# EAGLE design lin_node (EAGLE 6.5.0)
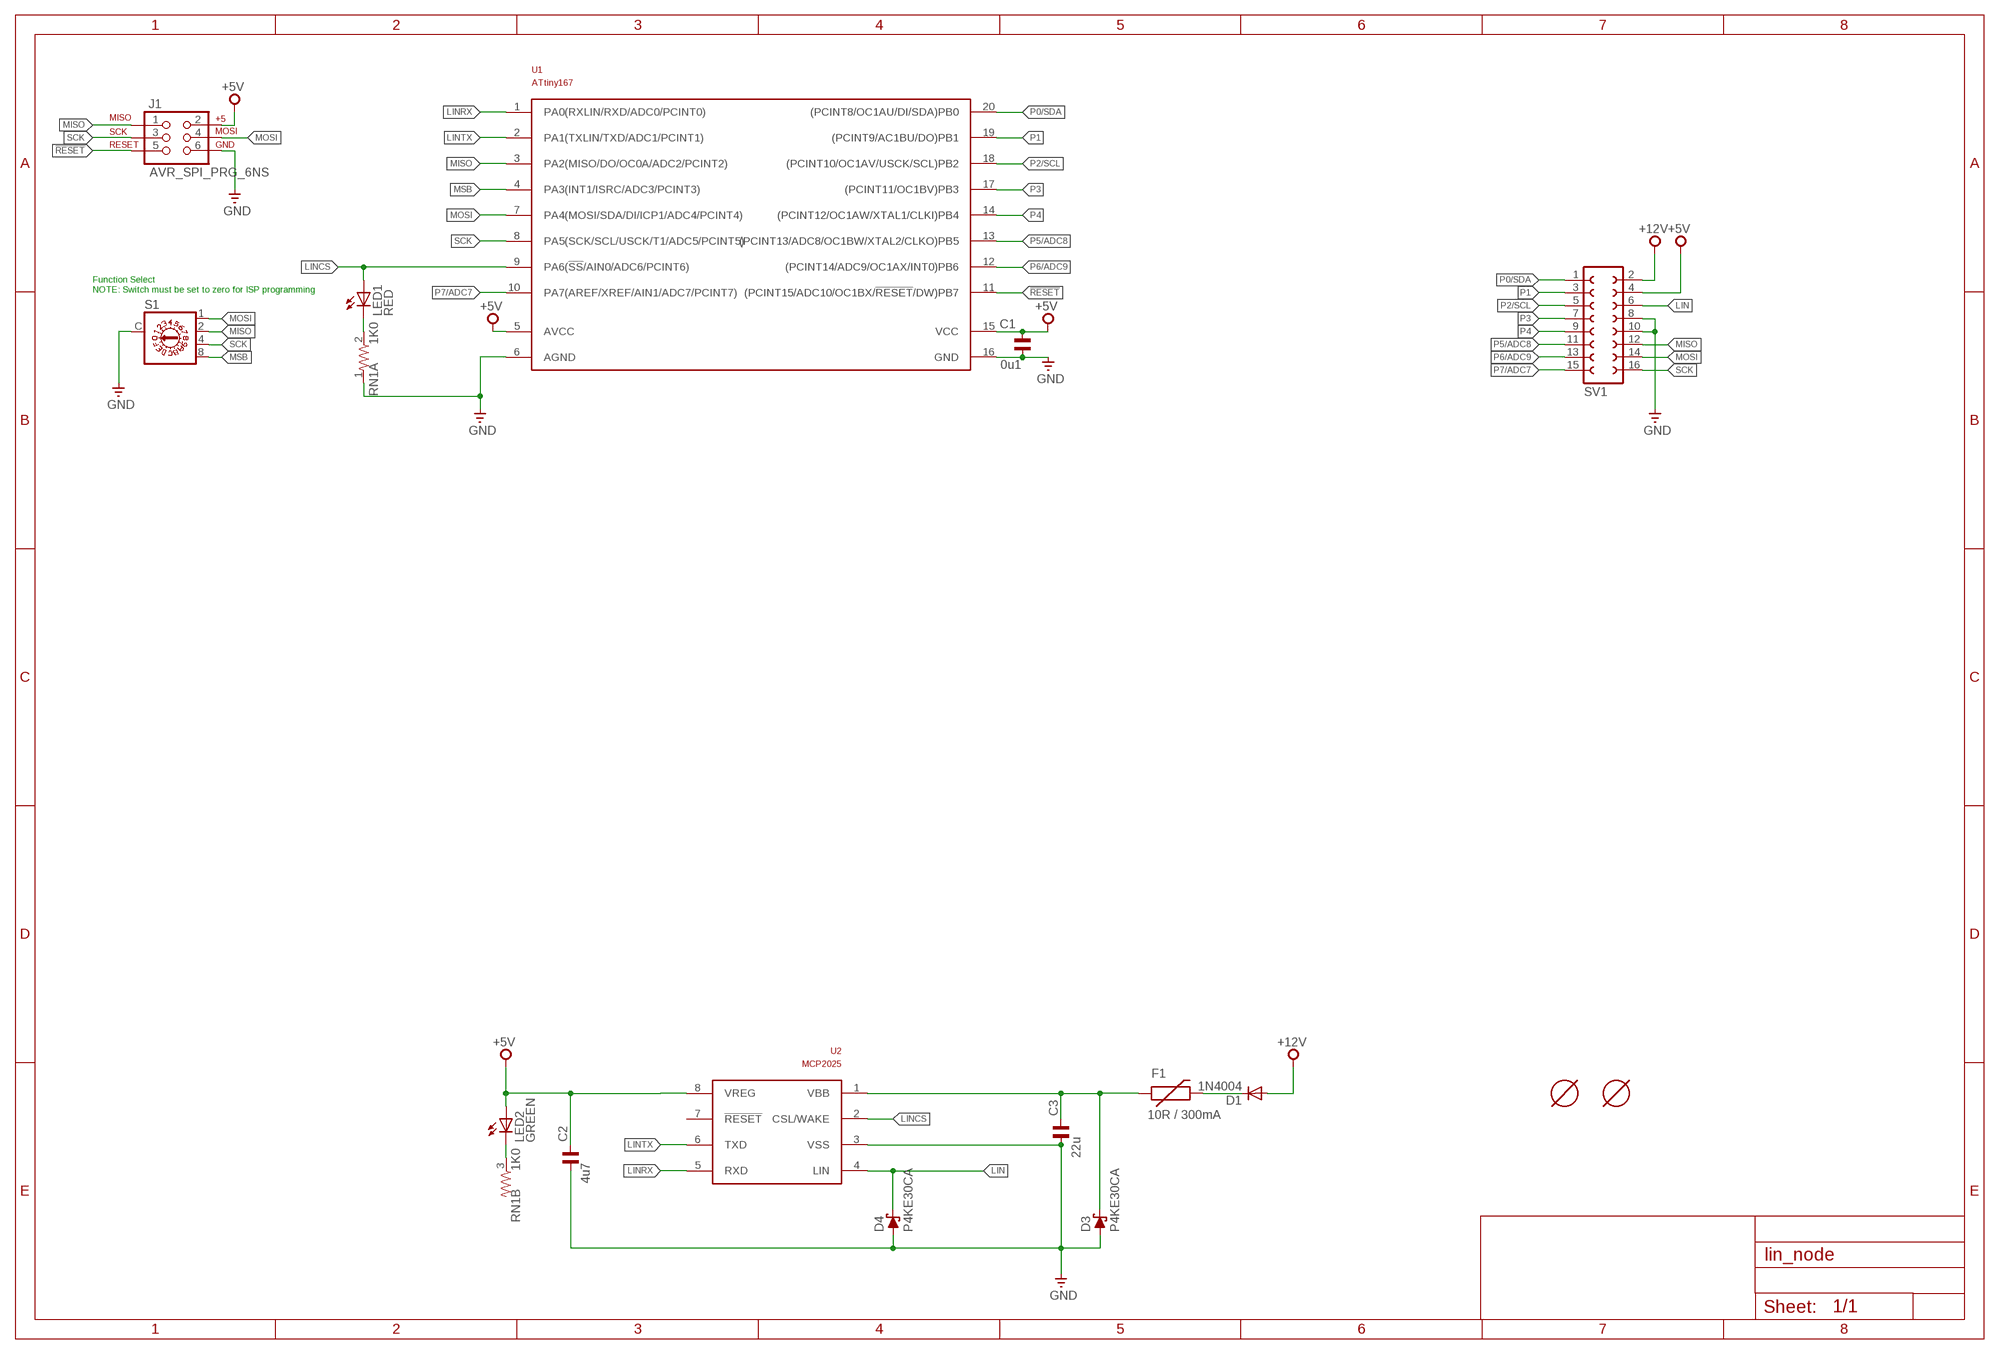
[diagram p0: schematic, sheet 1]

## Parts
C1  0u1  C-EU025-024X044  [C025-024X044]
C2  4u7  C-EU050-024X044  [C050-024X044]
C3  22u  C-EU050-024X044  [C050-024X044]
D1  1N4004  [DO41-10]
D3  P4KE30CA  P4KEXX  [DO41-10]
D4  P4KE30CA  P4KEXX  [DO41-10]
F1  10R / 300mA  PTCPTH  [PTC]
J1  AVR_SPI_PRG_6NS  [2X3-NS]
LED1  RED  LED3MM  [LED3MM]
LED2  GREEN  LED3MM  [LED3MM]
RN1  1K0  GE03R  [SIL4]
S1  P103  [P103]
SV1  FE08-2  [FE08-2]
U1  ATtiny167  ATTINY167  [SO20W]
U2  MCP2025  [SO08]
U$1  MOUNT-HOLE3.1MM  [MOUNT-HOLE3.1]
U$2  MOUNT-HOLE3.1MM  [MOUNT-HOLE3.1]

## Nets
!RESET: J1.5 U1.11((PCINT15/ADC10/OC1BX/!RESET!/DW)PB7)
+5V [power]: C1.1 C2.1 J1.2 LED2.A SV1.4 U1.5(AVCC) U1.15(VCC) U2.8(VREG)
+12V [power]: D1.A SV1.2
GND [power]: C1.2 C2.2 C3.2 D3.A D4.A J1.6 RN1.1 S1.C SV1.8 SV1.10 U1.6(AGND) U1.16(GND) U2.3(VSS)
LIN: D4.C SV1.6 U2.4(LIN)
LINCS: LED1.A U1.9(PA6(!SS!/AIN0/ADC6/PCINT6)) U2.2(CSL/WAKE)
LINRX: U1.1(PA0(RXLIN/RXD/ADC0/PCINT0)) U2.5(RXD)
LINTX: U1.2(PA1(TXLIN/TXD/ADC1/PCINT1)) U2.6(TXD)
MISO: J1.1 S1.2 SV1.12 U1.3(PA2(MISO/DO/OC0A/ADC2/PCINT2))
MOSI: J1.4 S1.1 SV1.14 U1.7(PA4(MOSI/SDA/DI/ICP1/ADC4/PCINT4))
MSB: S1.8 U1.4(PA3(INT1/ISRC/ADC3/PCINT3))
N$2 [power]: C3.1 D3.C F1.P$1 U2.1(VBB)
N$3: LED1.K(C) RN1.2
N$4: LED2.K(C) RN1.3
N$5 [power]: D1.C F1.P$2
P0/SDA: SV1.1 U1.20((PCINT8/OC1AU/DI/SDA)PB0)
P1: SV1.3 U1.19((PCINT9/AC1BU/DO)PB1)
P2/SCL: SV1.5 U1.18((PCINT10/OC1AV/USCK/SCL)PB2)
P3: SV1.7 U1.17((PCINT11/OC1BV)PB3)
P4: SV1.9 U1.14((PCINT12/OC1AW/XTAL1/CLKI)PB4)
P5/ADC8: SV1.11 U1.13((PCINT13/ADC8/OC1BW/XTAL2/CLKO)PB5)
P6/ADC9: SV1.13 U1.12((PCINT14/ADC9/OC1AX/INT0)PB6)
P7/ADC7: SV1.15 U1.10(PA7(AREF/XREF/AIN1/ADC7/PCINT7))
SCK: J1.3 S1.4 SV1.16 U1.8(PA5(SCK/SCL/USCK/T1/ADC5/PCINT5))
Unconnected: RN1.4 U2.7(!RESET)

## Notes on the sheet
- Function Select
  NOTE: Switch must be set to zero for ISP programming

## Library data of the parts
C1 = custom:C-EU: CAPACITOR, European symbol; PARTNO: FK28X7R1H104K
C2 = custom:C-EU: CAPACITOR, European symbol; PARTNO: FK28X5R0J475K
C3 = custom:C-EU: CAPACITOR, European symbol; PARTNO: FK22X5R1E226M
D1 = custom:1N4004: DIODE general purpose rectifier, 1 A; PARTNO: 1N4004-TP
D3 D4 = custom:P4KEXX: DIODE transient-voltage suppressor; PARTNO: P4KE30CA
F1 = custom:PTC: Resettable Fuse PTC Resettable Fuse. Spark Fun Electronics SKU : COM-08357; PARTNO: 600R150-RBZR
J1 = custom:AVR_SPI_PRG_6: AVR ISP 6 Pin This is the reduced ISP connector for AVR programming. Common on Arduino. This footprint will take up less PCB space and can be used with a 10-pin to 6-pin adapter such as SKU: BOB-08508
LED1 = custom:LED: LEDs Standard schematic elements and footprints for 5mm, 3mm, 1206, and 0603 sized LEDs. 5mm - Spark Fun Electronics SKU : COM-00529 (and others); PARTNO: C4SMF-RJS-CT0W0BB2
LED2 = custom:LED: LEDs Standard schematic elements and footprints for 5mm, 3mm, 1206, and 0603 sized LEDs. 5mm - Spark Fun Electronics SKU : COM-00529 (and others); PARTNO: C4SMF-GJS-CV0Y0792
RN1 = custom:GE03R: SIL RESISTOR; PARTNO: 4604X-101-103LF
S1 = custom:P103: DIL/CODE SWITCH; PARTNO: SH-7050MC
SV1 = custom:FE08-2: FEMALE HEADER; OC_FARNELL: unknown; OC_NEWARK: unknown
U1 = custom:ATTINY167; PARTNO: ATTINY167-SU
U2 = custom:MCP2025: LIN Transceiver with Voltage Regulator; PARTNO: MCP2025-500E/SN
U$1 U$2 = custom:MOUNT-HOLE

## Net classes
0 default: width 0.381 mm
1 power: width 0.635 mm

## Board
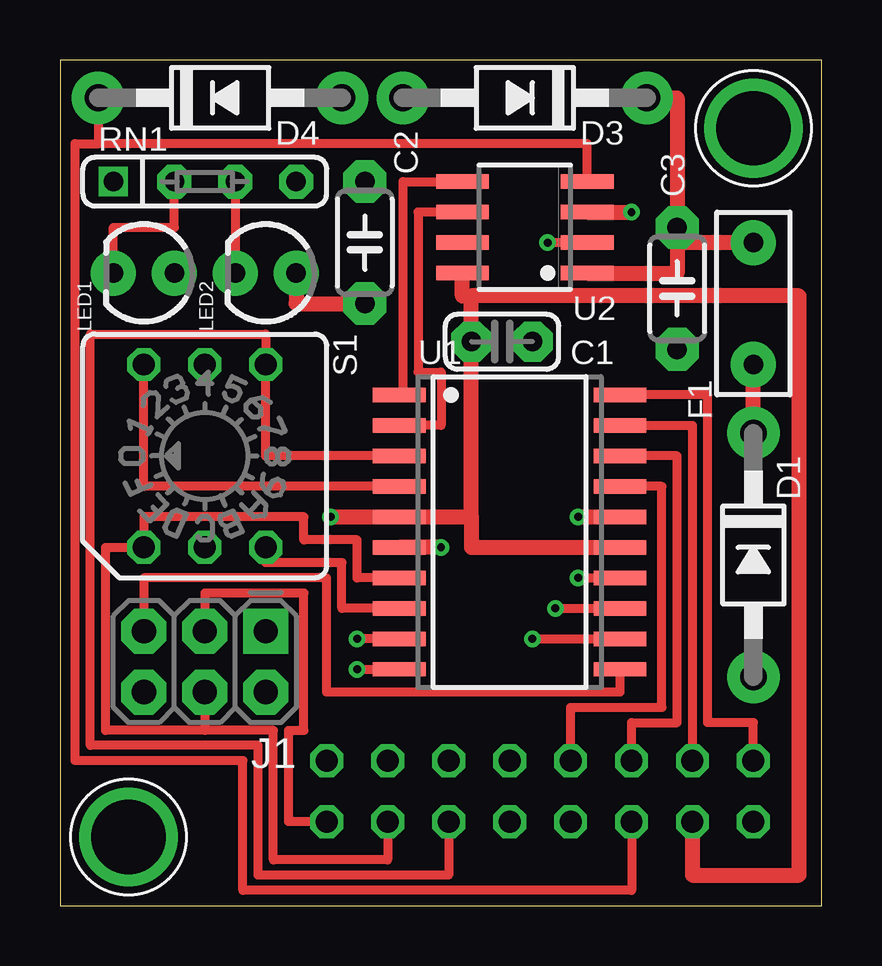
[diagram p1: board, top side]
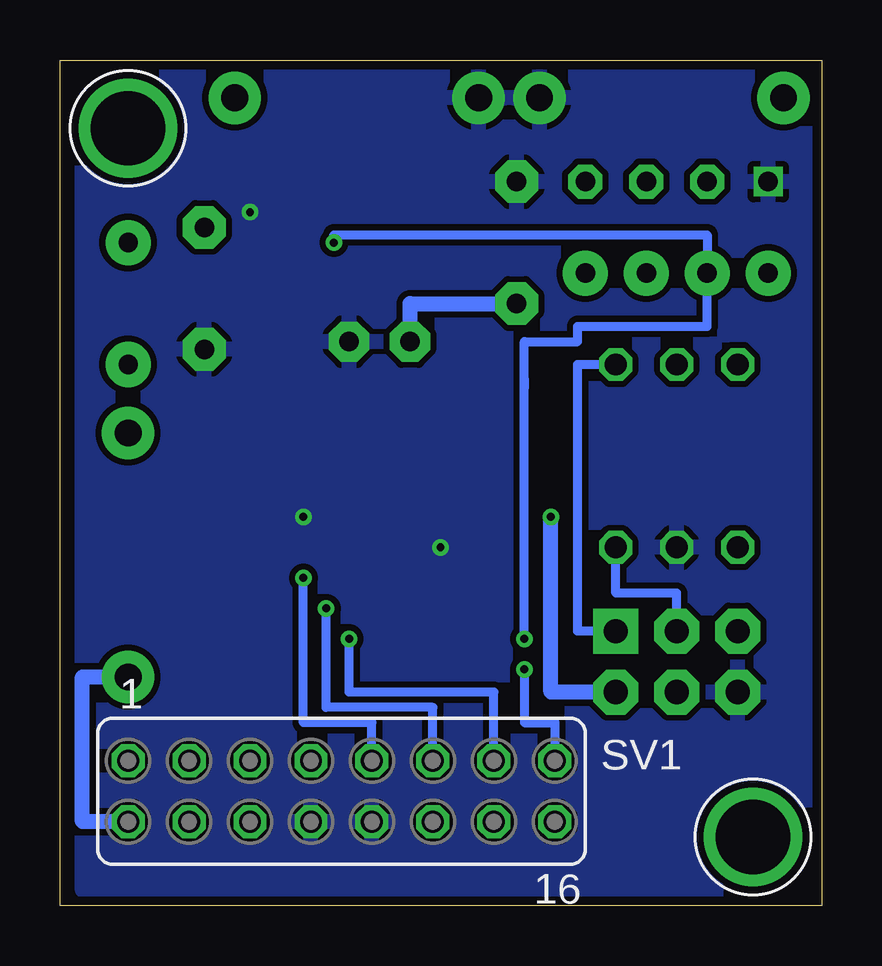
[diagram p2: board, bottom side, seen from below]

Size 31.73 x 35.23 mm. Coordinates in mm from the lower left corner, seen from the top.
Outline: 0,0 31.73,0 31.73,35.23 0,35.23 0,0
Copper layers (1*16): Top 0.0356mm / dielectric 1.5011mm / Bottom 0.0356mm
Design rules "LaenPCBOrder": minimum track width 6mil, minimum drill 13mil, track to track 6mil, track to pad 6mil, pad to pad 6mil, via to via 6mil, smd to smd 6mil, copper to edge 15mil, drill to drill 6mil, minimum pad ring 7mil, minimum via ring 7mil, stop-mask expansion 3mil, vias tented up to drill 0mil, thermal gap 10mil

### Footprints (pad centres in the part's own frame; a part is rotated, then mirrored left to right if it is on the bottom)
C025-024X044 = drill 0.813 pad 1.676 octagon: 1 -1.27,0; 2 1.27,0
C050-024X044 = drill 0.813 pad 1.778 octagon: 1 -2.54,0; 2 2.54,0
DO41-10 = drill 1.118 pad 2.184: A 5.08,0; C -5.08,0
PTC = drill 0.8 pad 1.88: P$1 -2.54,0; P$2 2.54,0
2X3-NS = drill 1.016 pad 1.88 square: 1 -2.54,-1.27 | drill 1.016 pad 1.88 octagon: 2 -2.54,1.27; 3 0,-1.27; 4 0,1.27; 5 2.54,-1.27; 6 2.54,1.27
LED3MM = drill 0.813 pad 1.88: A -1.27,0; K 1.27,0
SIL4 = drill 0.813 square: 1 -3.81,0 | drill 0.813 pad 1.422 octagon: 2 -1.27,0; 3 1.27,0; 4 3.81,0
P103 = drill 0.914 octagon: 1 3.81,-2.54; 2 -3.81,2.54; 4 3.81,2.54; 8 -3.81,-2.54; C 3.81,0; C1 -3.81,0
FE08-2 = drill 0.914 octagon: 1 -8.89,1.27; 2 -8.89,-1.27; 3 -6.35,1.27; 4 -6.35,-1.27; 5 -3.81,1.27; 6 -3.81,-1.27; 7 -1.27,1.27; 8 -1.27,-1.27; 9 1.27,1.27; 10 1.27,-1.27; 11 3.81,1.27; 12 3.81,-1.27; 13 6.35,1.27; 14 6.35,-1.27; 15 8.89,1.27; 16 8.89,-1.27
SO20W = smd 0.6 x 2.2: 1 -5.715,-4.6; 2 -4.445,-4.6; 3 -3.175,-4.6; 4 -1.905,-4.6; 5 -0.635,-4.6; 6 0.635,-4.6; 7 1.905,-4.6; 8 3.175,-4.6; 9 4.445,-4.6; 10 5.715,-4.6; 11 5.715,4.6; 12 4.445,4.6; 13 3.175,4.6; 14 1.905,4.6; 15 0.635,4.6; 16 -0.635,4.6; 17 -1.905,4.6; 18 -3.175,4.6; 19 -4.445,4.6; 20 -5.715,4.6
SO08 = smd 0.6 x 2.2: 1 -1.905,-2.6; 2 -0.635,-2.6; 3 0.635,-2.6; 4 1.905,-2.6; 5 1.905,2.6; 6 0.635,2.6; 7 -0.635,2.6; 8 -1.905,2.6
MOUNT-HOLE3.1 = drill 3.1 pad 4.1: P$1 0,0

### Placement (x,y rotation side)
C1  18.41,23.5 0 top
C2  12.7,27.62 90 top
C3  25.72,25.72 270 top
D1  28.89,14.61 270 top
D3  19.37,33.66 180 top
D4  6.67,33.66 0 top
F1  28.89,25.08 270 top
J1  6.03,10.16 180 top
LED1  3.49,26.35 180 top
LED2  8.57,26.35 180 top
RN1  6.03,30.16 0 top
S1  6.03,18.73 270 top
SV1  20,4.76 0 bottom
U1  18.73,15.56 270 top
U2  19.37,28.26 90 top
U$1  2.86,2.86 0 top
U$2  28.89,32.38 0 top

### Tracks (layer width: path | path; a pad name or v marks a point on that pad's centre or on a via)
!RESET
  Top 0.381: J1.5 3.49,13.65 11.11,13.65 11.11,8.89 23.33,8.89 U1.11
+5V  (via drill 0.33)
  Top 0.635: 17.14,16.19 17.14,14.92 U1.15 | SV1.4 26.35,1.27 30.8,1.27 30.8,25.4 17.14,25.4 | LED2.A 9.84,25.08 C2.1 | 17.14,25.4 16.77,25.4 U2.8 | v11.28,16.19 U1.5 17.14,16.19 | 17.14,25.4 C1.1 17.14,16.19
  Bottom 0.635: J1.2 11.28,8.89 v11.28,16.19 | C1.1 17.14,25.08 C2.1
+12V
  Bottom 0.635: SV1.2 30.8,3.49 30.8,9.53 D1.A
GND  (via drill 0.33)
  Top 0.635: v15.88,14.92 U1.6 | v21.59,16.19 U1.16 | U2.3 v23.81,28.89
  pour Bottom (isolate 0.254): 0.64,0.64 30.8,0.64 30.8,34.61 0.64,34.61
LIN
  Top 0.381: SV1.6 23.81,0.64 7.62,0.64 7.62,6.03 0.64,6.03 0.64,31.75 1.59,31.75 | U2.4 21.97,31.75 1.59,31.75 | D4.C 1.59,31.75
LINCS  (via drill 0.33)
  Top 0.381: U1.9 v12.38,11.11 | U2.2 v20.32,27.62
  Bottom 0.381: v12.38,11.11 12.38,21.91 | 12.38,21.91 12.38,21.59 | 12.38,21.59 12.38,21.91 | 12.38,21.91 12.38,23.5 10.16,23.5 10.16,24.13 4.76,24.13 LED1.A 4.76,27.94 20.32,27.94 v20.32,27.62 | 12.38,21.91 12.38,21.59
LINRX
  Top 0.381: U2.5 14.29,30.16 14.29,21.27 U1.1
LINTX
  Top 0.381: U2.6 14.92,28.89 14.92,22.23 15.88,22.23 15.88,20 U1.2
MISO
  Top 0.381: U1.3 8.57,18.73 S1.2 8.57,23.81 1.27,23.81 1.27,6.67 8.26,6.67 8.26,1.27 16.19,1.27 SV1.12
  Bottom 0.381: J1.1 10.16,11.43 10.16,22.54 S1.2
MOSI
  Top 0.381: U1.7 12.38,13.65 12.38,15.24 10.16,15.24 10.16,16.19 3.49,16.19 S1.1 1.91,14.92 1.91,7.3 6.03,7.3 | J1.4 6.03,7.3 | SV1.14 13.65,1.91 8.89,1.91 8.89,7.3 6.03,7.3
MSB
  Top 0.381: U1.4 3.49,17.46 S1.8
N$2
  Top 0.635: U2.1 25.72,26.35 25.72,27.62 | 25.72,27.62 C3.1 25.72,33.66 D3.C | F1.P$1 25.72,27.62
N$3
  Top 0.381: LED1.K 2.22,28.26 4.76,28.26 RN1.2
N$4
  Top 0.381: RN1.3 LED2.K
N$5
  Top 0.635: D1.C F1.P$2
P0/SDA
  Top 0.381: SV1.1 28.89,7.62 26.99,7.62 26.99,21.27 U1.20
P1
  Top 0.381: U1.19 26.35,20 SV1.3
P2/SCL
  Top 0.381: SV1.5 23.81,7.62 25.72,7.62 25.72,18.73 U1.18
P3
  Top 0.381: SV1.7 21.27,8.26 25.08,8.26 25.08,17.46 U1.17
P4  (via drill 0.33)
  Top 0.381: v21.59,13.65 U1.14
  Bottom 0.381: SV1.9 18.73,7.62 21.59,7.62 v21.59,13.65
P5/ADC8  (via drill 0.33)
  Top 0.381: v20.64,12.38 U1.13
  Bottom 0.381: SV1.11 16.19,8.26 20.64,8.26 v20.64,12.38
P6/ADC9  (via drill 0.33)
  Top 0.381: v19.68,11.11 U1.12
  Bottom 0.381: SV1.13 13.65,8.89 19.68,8.89 v19.68,11.11
P7/ADC7  (via drill 0.33)
  Top 0.381: v12.38,9.84 U1.10
  Bottom 0.381: v12.38,9.84 12.38,7.62 11.11,7.62 SV1.15
SCK
  Top 0.381: U1.8 11.75,12.38 11.75,14.29 8.57,14.29 S1.4 | SV1.16 9.53,3.49 9.53,7.3 10.16,7.3 10.16,13.02 6.03,13.02 J1.3
  Bottom 0.381: J1.3 6.03,13.02 8.57,13.02 S1.4

### Text on the board
bDocu: LIN slave controller v1 / ©2014 michael smith | P7/ADC7 | P6/ADC9 | P5/ADC8 | P4 | P3 | P2/SCL | P1 | P0/SDA | SCK | MOSI | MISO | GND | LIN | 5V | 12V